# Altium schematic sheet Sheet1.SchDoc: Optical Audio Receiver
size A4; ApprovedBy: Matej Gomboc; CheckedBy: Matej Gomboc; Author: Matej Gomboc; DrawnBy: Matej Gomboc; Engineer: Matej Gomboc; DocumentNumber: 1; Revision: 1.0; SheetNumber: 1; SheetTotal: 1; DocumentName: Optical Audio Receiver; ProjectName: Optical Audio Receiver
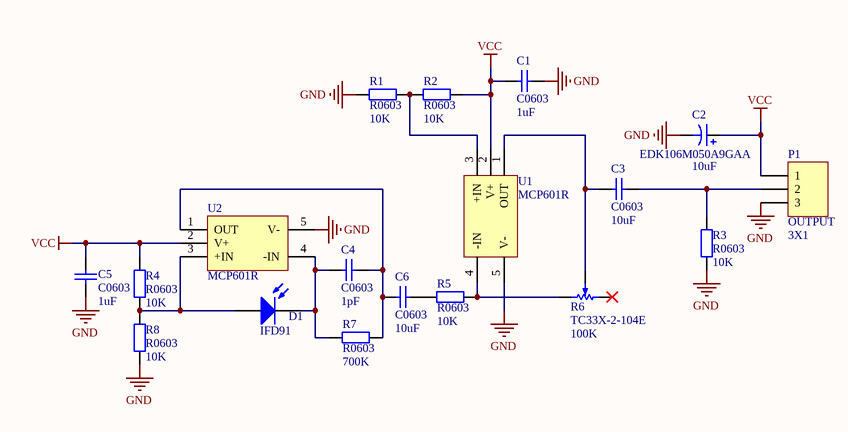
[diagram p0: Sheet1.SchDoc]

## Parts
C1  C0603  value 1uF  [1608[0603]]
C2  EDK106M050A9GAA  value 10uF  [EDK106M050A9GAA]
C3  C0603  value 10uF  [1608[0603]]
C4  C0603  value 1pF  [1608[0603]]
C5  C0603  value 1uF  [1608[0603]]
C6  C0603  value 10uF  [1608[0603]]
D1  IFD91  [IFD91]
P1  OUTPUT  value 3X1  [HDR1X3]
R1  R0603  value 10K  [J1-0603]
R2  R0603  value 10K  [J1-0603]
R3  R0603  value 10K  [J1-0603]
R4  R0603  value 10K  [J1-0603]
R5  R0603  value 10K  [J1-0603]
R6  TC33X-2-104E  value 100K  [TC33X-2-104E]
R7  R0603  value 700K  [J1-0603]
R8  R0603  value 10K  [J1-0603]
U1  MCP601R  [MCP601_SOT23]
U2  MCP601R  [MCP601_SOT23]

## Nets
GND: C1.2 C2.2 C5.2 P1.3 R1.2 R3.2 R8.1 U1.5(V-) U2.5(V-)
VCC: C1.1 C2.1 C5.1 P1.1 R2.1 R4.1 U1.2(V+) U2.2(V+)
NetC3_1: C3.1 R6.2(W) U1.1(OUT)
NetC3_2: C3.2 P1.2 R3.1
NetC4_1: C4.1 D1.1(K) R7.2 U2.4(-IN)
NetC4_2: C4.2 C6.1 R7.1 U2.1(OUT)
NetC6_2: C6.2 R5.2
NetD1_2: D1.2(A) R4.2 R8.2 U2.3(+IN)
NetR1_1: R1.1 R2.2 U1.3(+IN)
NetR5_1: R5.1 R6.1(+) U1.4(-IN)

Not connected (* = marked no-connect by the designer): R6 3(-)*

## Library data of the parts
C1 C3-C6 = Cap: Ceramic Capacitor
C2 = Cap Pol1: Aluminium Electrolytic Capacitor
D1 = IFD91: Fotodiode For PMMA
P1 = Header 3: Header, 3-Pin
R1-R5 R7 R8 = Res2: Resistor
R6 = TC33X-2-104E: Potentiometer
U1 U2 = MCP601R: Single Supply Operational Amplifier